# EAGLE design doogie_top_board (EAGLE 9.4.2)

## Sheet 1 of 2
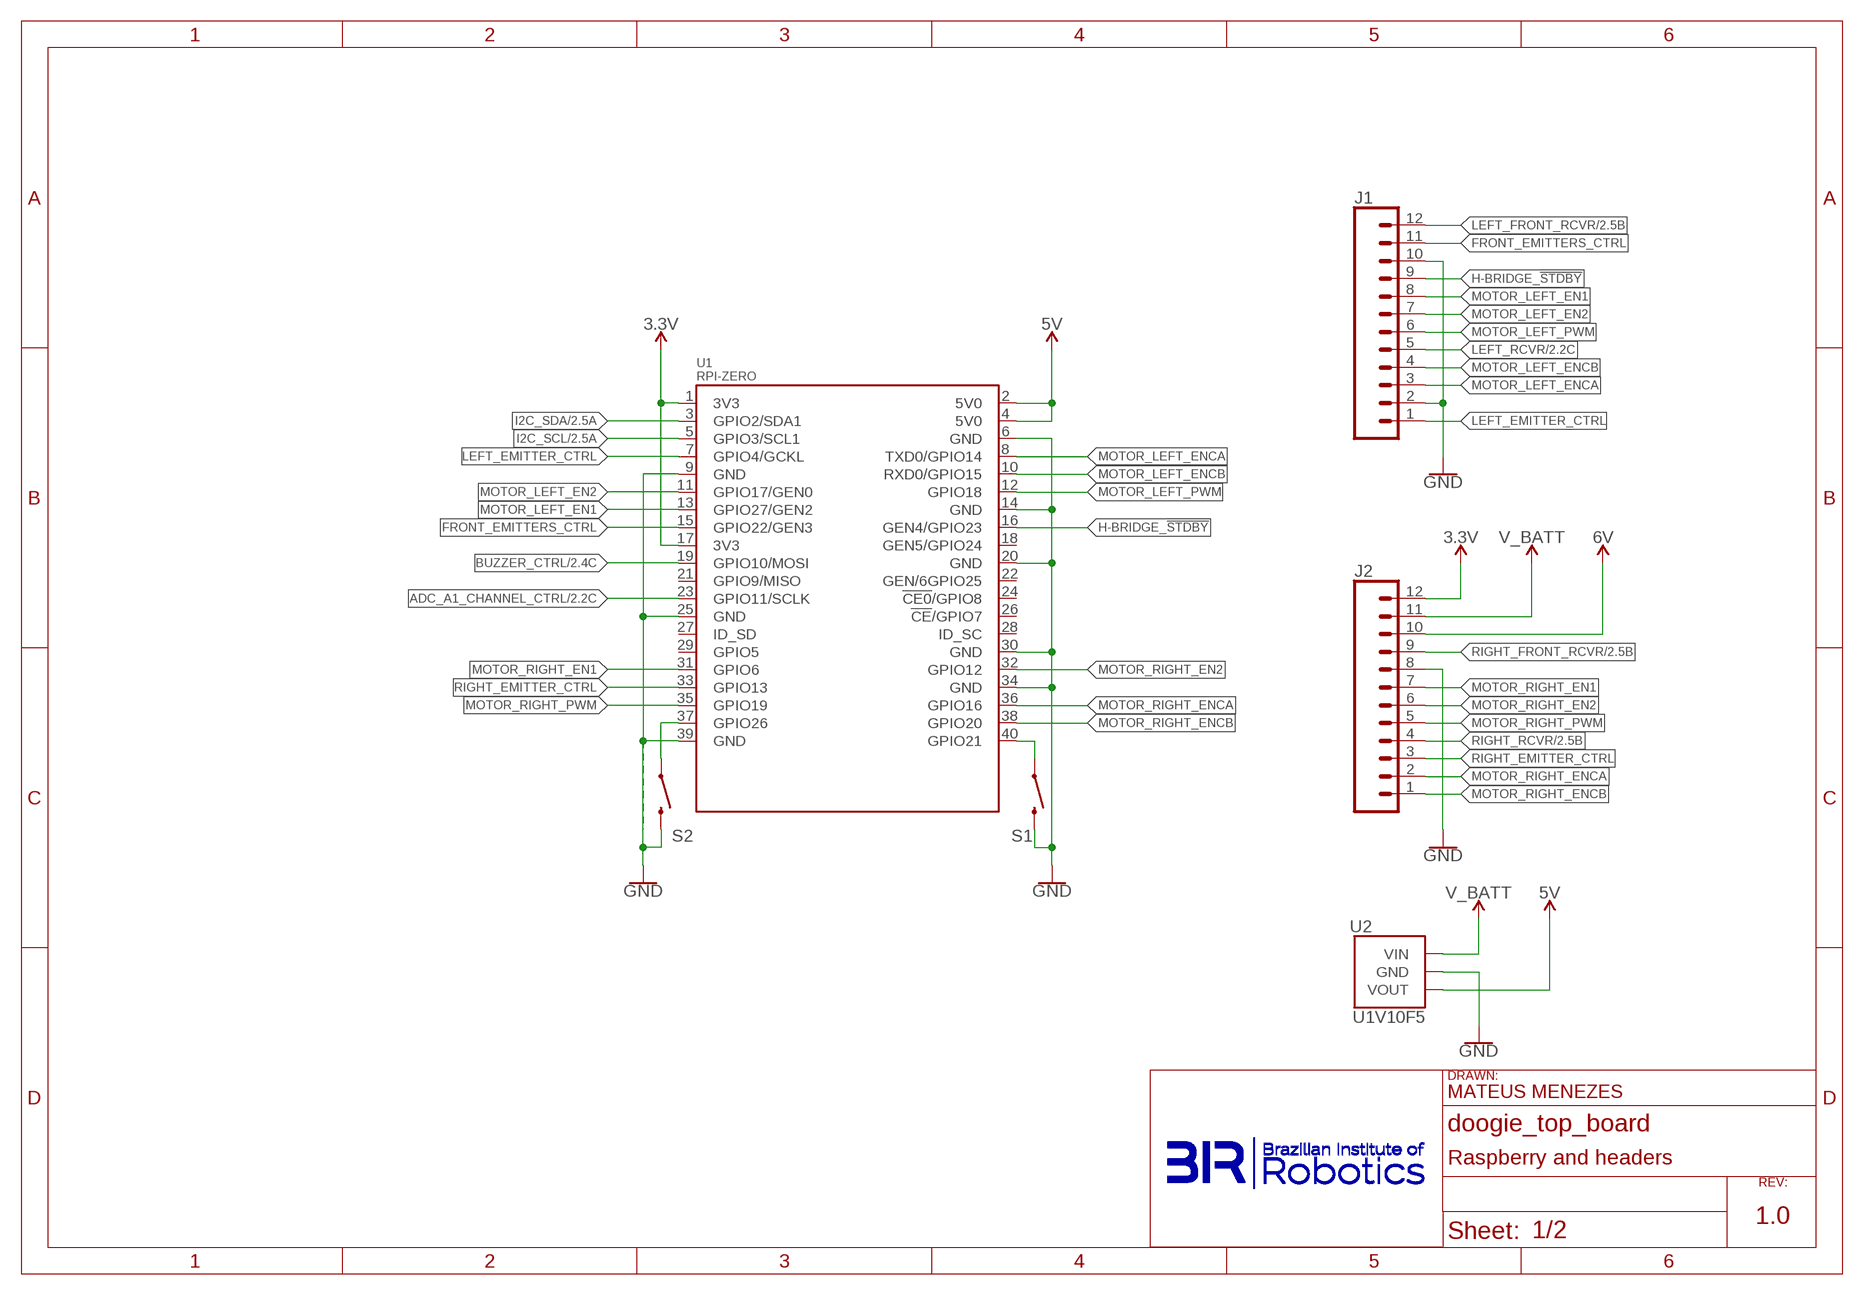
[diagram p0: schematic, sheet 1]
U$1 (FRAME_A4P): DESIGNER_NAME: MATEUS MENEZES; PAGE_DESCRIPTION: Raspberry and headers; REV_NUMBER: 1.0

### Parts
J1  CONN_12  [1X12]
J2  CONN_12  [1X12]
S1  MOMENTARY-SWITCH-SPST-PTH-6.0MM  [TACTILE_SWITCH_PTH_6.0MM]
S2  MOMENTARY-SWITCH-SPST-PTH-6.0MM  [TACTILE_SWITCH_PTH_6.0MM]
U1  RPI-ZERO  [RASPBERRYPI_BASTELSTUBE_V13_RASPI_BOARD_B+_FULL]
U2  U1V10F5  [U1V10F5]

### Nets
3.3V: J2.12 U1.1(3V3) U1.17(3V3) ; also sheet 2
5V: U1.2(5V0) U1.4(5V0) U2.VOUT ; also sheet 2
ADC_A1_CHANNEL_CTRL: U1.23(GPIO11/SCLK) ; also sheet 2
BUZZER_CTRL: U1.19(GPIO10/MOSI) ; also sheet 2
FRONT_EMITTERS_CTRL: J1.11 U1.15(GPIO22/GEN3)
GND: J1.2 J1.10 J2.8 S1.3 S2.3 U1.6(GND) U1.9(GND) U1.14(GND) U1.20(GND) U1.25(GND) U1.30(GND) U1.34(GND) U1.39(GND) U2.GND ; also sheet 2
H-BRIDGE_!STDBY: J1.9 U1.16(GEN4/GPIO23)
I2C_SCL: U1.5(GPIO3/SCL1) ; also sheet 2
I2C_SDA: U1.3(GPIO2/SDA1) ; also sheet 2
LEFT_EMITTER_CTRL: J1.1 U1.7(GPIO4/GCKL)
LEFT_FRONT_RCVR: J1.12 ; also sheet 2
LEFT_RCVR: J1.5 ; also sheet 2
MOTOR_LEFT_EN1: J1.8 U1.13(GPIO27/GEN2)
MOTOR_LEFT_EN2: J1.7 U1.11(GPIO17/GEN0)
MOTOR_LEFT_ENCA: J1.3 U1.8(TXD0/GPIO14)
MOTOR_LEFT_ENCB: J1.4 U1.10(RXD0/GPIO15)
MOTOR_LEFT_PWM: J1.6 U1.12(GPIO18)
MOTOR_RIGHT_EN1: J2.7 U1.31(GPIO6)
MOTOR_RIGHT_EN2: J2.6 U1.32(GPIO12)
MOTOR_RIGHT_ENCA: J2.2 U1.36(GPIO16)
MOTOR_RIGHT_ENCB: J2.1 U1.38(GPIO20)
MOTOR_RIGHT_PWM: J2.5 U1.35(GPIO19)
N$3: S2.1 U1.37(GPIO26)
N$4: S1.1 U1.40(GPIO21)
RIGHT_EMITTER_CTRL: J2.3 U1.33(GPIO13)
RIGHT_FRONT_RCVR: J2.9 ; also sheet 2
RIGHT_RCVR: J2.4 ; also sheet 2
V_BATT: J2.11 U2.VIN ; also sheet 2
VOUT: J2.10 ; supply symbol labelled 6V ; also sheet 2
Unconnected: U1.18(GEN5/GPIO24) U1.21(GPIO9/MISO) U1.22(GEN/6GPIO25) U1.24(!CE0!/GPIO8) U1.26(!CE!/GPIO7) U1.27(ID_SD) U1.28(ID_SC) U1.29(GPIO5)

## Sheet 2 of 2
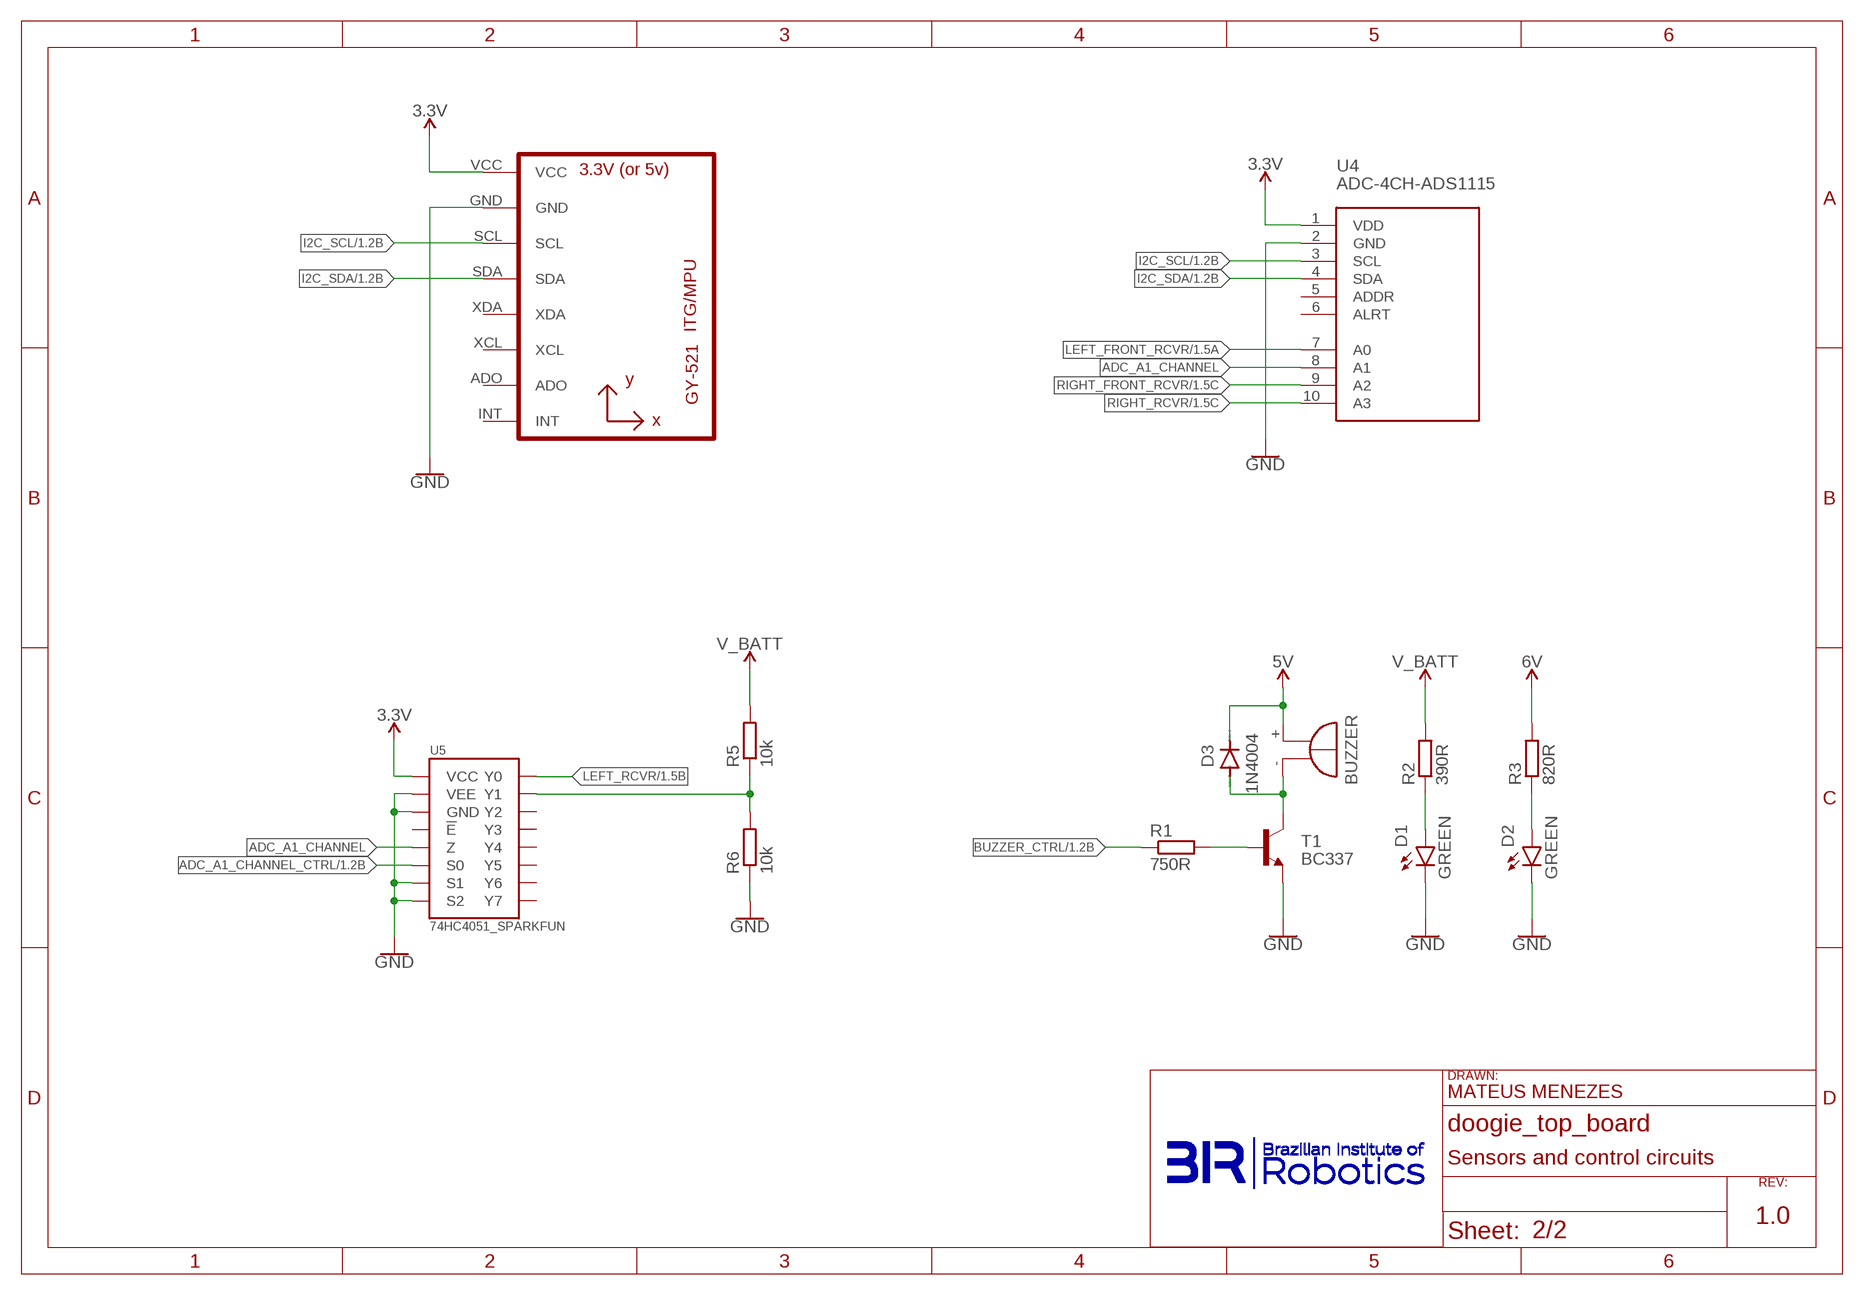
[diagram p1: schematic, sheet 2]
U$4 (FRAME_A4P): DESIGNER_NAME: MATEUS MENEZES; PAGE_DESCRIPTION: Sensors and control circuits; REV_NUMBER: 1.0

### Parts
BUZZER  F/TMB  [F/TMB]
D1  GREEN  LED3MM  [LED_3MM]
D2  GREEN  LED3MM  [LED_3MM]
D3  1N4004  [DO41-10]
R1  750R  R-EU_0204/7  [0204/7]
R2  390R  R-EU_0204/7  [0204/7]
R3  820R  R-EU_0204/7  [0204/7]
R5  10k  R-EU_0204/7  [0204/7]
R6  10k  R-EU_0204/7  [0204/7]
T1  BC337  [TO92]
U3  GY-521MPU6050  [GY-521]
U4  ADC-4CH-ADS1115  [ADC-4CH-ADS1115]
U5  74HC4051_SPARKFUN  [74HC4051_SPARKFUN]

### Nets
3.3V: U3.VCC U4.1(VDD) U5.VCC U5.VCC@1(VCC) ; also sheet 1
5V: BUZZER.+ D3.C ; also sheet 1
ADC_A1_CHANNEL: U4.8(A1) U5.Z
ADC_A1_CHANNEL_CTRL: U5.S0 ; also sheet 1
BUZZER_CTRL: R1.1 ; also sheet 1
GND: D1.K(C) D2.K(C) R6.1 T1.1(E) U3.GND U4.2(GND) U5.GND U5.GND@1(GND) U5.S1 U5.S2 U5.VEE U5.VEE@1(VEE) ; also sheet 1
I2C_SCL: U3.SCL U4.3(SCL) ; also sheet 1
I2C_SDA: U3.SDA U4.4(SDA) ; also sheet 1
LEFT_FRONT_RCVR: U4.7(A0) ; also sheet 1
LEFT_RCVR: U5.Y0 ; also sheet 1
N$1: BUZZER.- D3.A T1.3(C)
N$2: R1.2 T1.2(B)
N$5: D1.A R2.1
N$6: D2.A R3.1
N$9: R5.1 R6.2 U5.Y1
RIGHT_FRONT_RCVR: U4.9(A2) ; also sheet 1
RIGHT_RCVR: U4.10(A3) ; also sheet 1
V_BATT: R2.2 R5.2 ; also sheet 1
VOUT: R3.2 ; supply symbol labelled 6V ; also sheet 1
Unconnected: U3.ADO U3.INT U3.XCL U3.XDA U4.5(ADDR) U4.6(ALRT) U5.!E U5.Y2 U5.Y3 U5.Y4 U5.Y5 U5.Y6 U5.Y7

## Library data of the parts
BUZZER = buzzer:F/TMB: BUZZER Source: Buerklin; OC_FARNELL: unknown; OC_NEWARK: unknown
D1 D2 = SparkFun-LED:LED: LED (Generic) Standard schematic elements and footprints for 5mm, 3mm, 1206, and 0603 sized LEDs. Generic LEDs with no color specified.; PROD_ID: DIO-08794
D3 = diode:1N4004: DIODE general purpose rectifier, 1 A
J1 J2 = SparkFun-Connectors:CONN_12: Multi connection point. Often used as Generic Header-pin footprint for 0.1 inch spaced/style header connections On any of the 0.1 inch spaced packages, you can populate with these: Break Away Headers - Straight <https://www.sparkfun.com/products/116> (PRT-00116) Break Away Male Headers - Right Angle <https://www.sparkfun.com/products/553> (PRT-00553) Female Headers <https://www.sparkfun.com/products/115> (PRT-00115) Break Away Headers - Machine Pin <https://www.sparkfun.com/products/117> (PRT-00117) Break Away Female Headers - Swiss Machine Pin <https://www.sparkfun.com/products/743> (PRT-00743) For SCREWTERMINALS and SPRING TERMINALS visit here: Screw Terimnals on SparkFun.com <https://www.sparkfun.com/search/results?term=Screw+Terminals> (5mm/3.5mm/2.54mm spacing) This device is also useful as a general connection point to wire up your design to another part of your project. Our various solder wires solder well into these plated through hole pads. Hook-Up Wire - Assortment (Stranded, 22 AWG) <https://www.sparkfun.com/products/11375> (PRT-11375) Hook-Up Wire - Assortment (Solid Core, 22 AWG) <https://www.sparkfun.com/products/11367> (PRT-11367) View the entire wire category on our website here <https://www.sparkfun.com/categories/141> Special notes: Molex polarized connector foot print use with SKU : PRT-08231 with associated crimp pins and housings. 1MM SMD Version SKU: PRT-10208 NOTES ON THE VARIANTS LOCK and LOCK_LONGPADS... This footprint was designed to help hold the alignment of a through-hole component (i.e. 6-pin header) while soldering it into place. You may notice that each hole has been shifted either up or down by 0.005 of an inch from it's more standard position (which is a perfectly straight line). This slight alteration caused the pins (the squares in the middle) to touch the edges of the holes. Because they are alternating, it causes a "brace" to hold the component in place. 0.005 has proven to be the perfect amount of "off-center" position when using our standard breakaway headers. Although looks a little odd when you look at the bare footprint, once you have a header in there, the alteration is very hard to notice. Also,if you push a header all the way into place, it is covered up entirely on the bottom side.
R1-R3 R5 R6 = rcl:R-EU_: RESISTOR, European symbol; SPICEPREFIX: R
S1 S2 = SparkFun-Switches:MOMENTARY-SWITCH-SPST: Momentary Switch (Pushbutton) - SPST Normally-open (NO) SPST momentary switches (buttons, pushbuttons). Variants PTH-12MM - 12mm square, through-hole Momentary Pushbutton Switch - 12mm Square <https://www.sparkfun.com/products/9190> (COM-09190) PTH-6.0MM, PTH-6.0MM-KIT - 6.0mm square, through-hole Mini Pushbutton Switch <https://www.sparkfun.com/products/97> (COM-00097) KIT package intended for soldering kit's - only one side of pads' copper is exposed. PTH-RIGHT-ANGLE-KIT - Right-angle, through-hole Right Angle Tactile Button <https://www.sparkfun.com/products/10791> - Used on SparkFun BigTime Watch Kit <https://www.sparkfun.com/products/11734> SMD-12MM - 12mm square, surface-mount Tactile Button - SMD (12mm) <https://www.sparkfun.com/products/12993> (COM-12993) Used on SparkFun PicoBoard <https://www.sparkfun.com/products/11888> SMD-4.5MM - 4.5mm Square Trackball Switch Used on SparkFun Blackberry Trackballer Breakout <https://www.sparkfun.com/products/13169> SMD-4.6MMX2.8MM - 4.60mm x 2.80mm, surface mount Used on SparkFun SAMD21 Mini Breakout <https://www.sparkfun.com/products/13664> SMD-5.2MM, SMD-5.2-REDUNDANT - 5.2mm square, surface-mount Mini Pushbutton Switch - SMD <https://www.sparkfun.com/products/8720> (COM-08720) Used on Arduino Pro Mini <https://www.sparkfun.com/products/11114> REDUNDANT package connects both switch circuits together SMD-6.0X3.5MM - 6.0 x 3.5mm, surface mount Momentary Reset Switch SMD <https://www.sparkfun.com/products/8229> (COM-08229) SMD-6.2MM-TALL - 6.2mm square, surface mount Tactile Button - SMD (6mm) <https://www.sparkfun.com/products/12992> Used on SparkFun Digital Sandbox <https://www.sparkfun.com/products/12651> SMD-RIGHT-ANGLE - Right-angle, surface mount Used on SparkFun Block for Intel® Edison - Arduino <https://www.sparkfun.com/products/13036>; PROD_ID: SWCH-08441; SF_SKU: COM-00097
T1 = transistor:BC337: NPN TRANSISTOR
U1 = doogie:RPI-ZERO
U2 = pololu:U1V10F5: Pololu 5V Step-Up Voltage Regulator U1V10F5 This tiny (0.35″×0.45″) U1V10F5 switching step-up (or boost) voltage regulator efficiently generates 5 V from input voltages as low as 0.5 V. Unlike most boost regulators, the U1V10F5 automatically switches to a linear down-regulation mode when the input voltage exceeds the output. The pins have a 0.1″ spacing, making this board compatible with standard solderless breadboards and perfboards. More information about U1V10F5 device is available here: https://www.pololu.com/product/2564/resources
U3 = doogie:GY-521
U4 = doogie:ADC-4CH-ADS1115: 4 Channel 16-Bit Analog-to-Digital Converter based on ADS1115 chip Arduino ADS1115 Getting Started Tutorial is available here: http://henrysbench.capnfatz.com/henrys-bench/arduino-voltage-measurements/arduino-ads1115-module-getting-started-tutorial/ ADS1115 datasheet is available here: http://www.ti.com/lit/ds/symlink/ads1115.pdf Click here to find device on ebay.com <http://www.ebay.com/sch/ads1115+module>
U5 = doogie:74HC4051_SPARKFUN

## Board
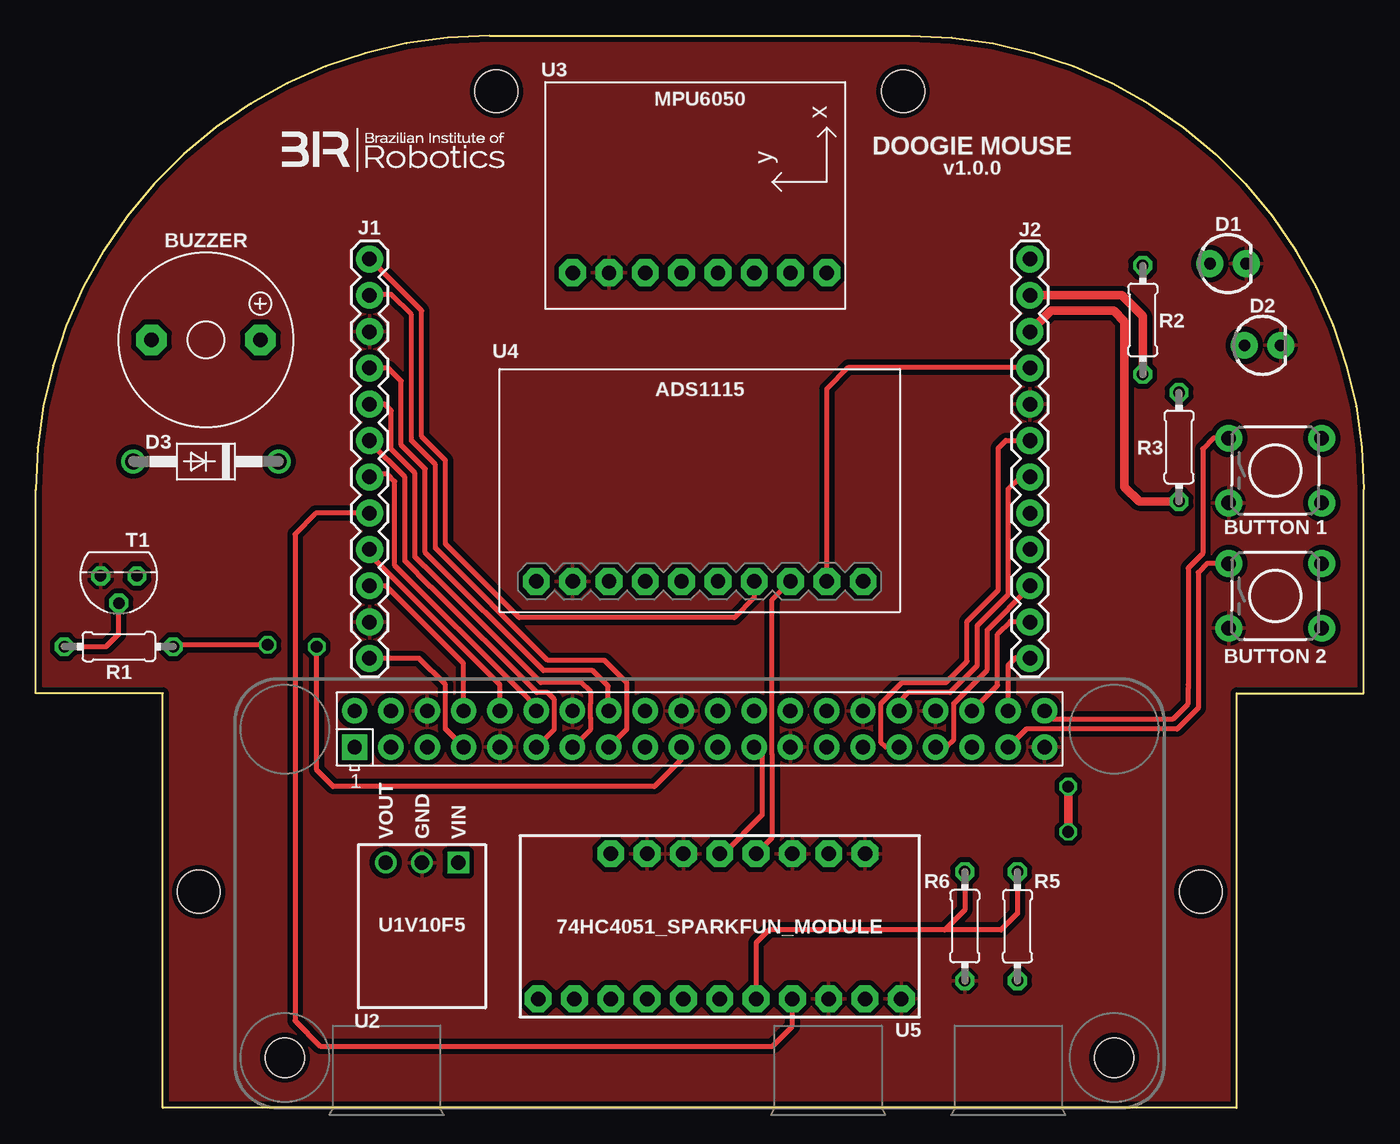
[diagram p2: board, top side]
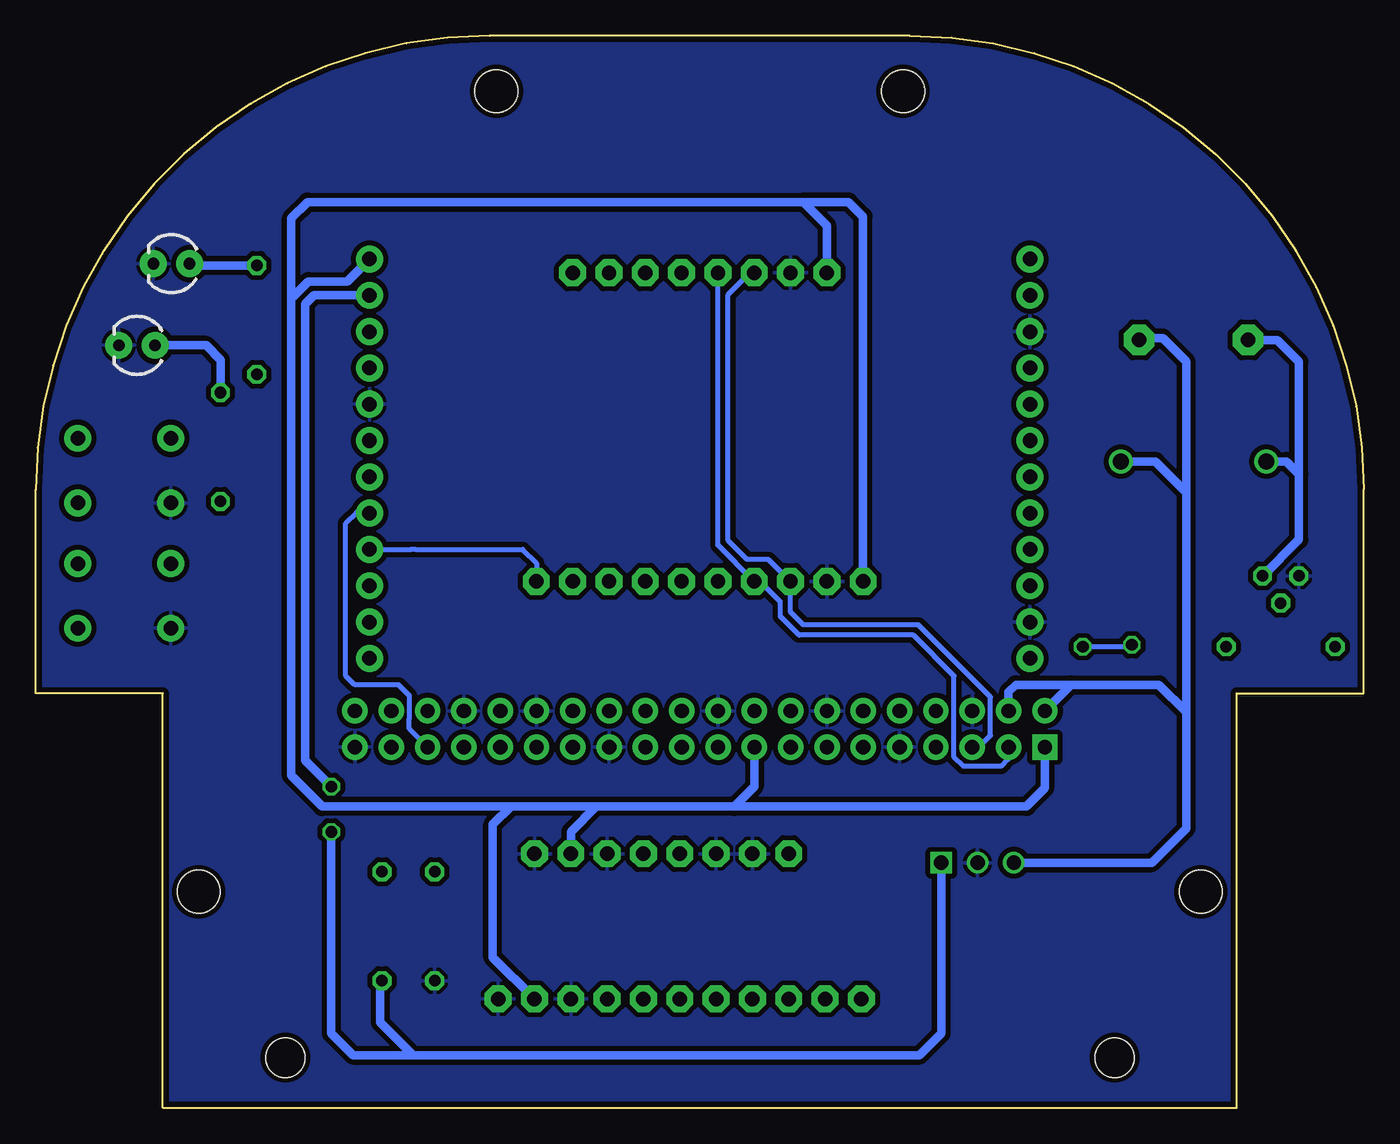
[diagram p3: board, bottom side, seen from below]

Size 92.9 x 75 mm. Coordinates in mm from the lower left corner, seen from the top.
Outline: 84.01,0 8.89,0 8.89,29 0,29 0,43.25 arc-90 31.75,75 61.15,75 arc-90 92.9,43.25 92.9,29 84.01,29 84.01,0
Copper layers (1*16): Top 0.035mm / dielectric 1.5mm / Bottom 0.035mm
Design rules "doogie_drc *": minimum track width 8mil, minimum drill 19mil, track to track 14mil, track to pad 8mil, pad to pad 8mil, via to via 8mil, smd to smd 8mil, copper to edge 10mil, drill to drill 8mil, minimum pad ring 10mil, minimum via ring 8mil, stop-mask expansion 4mil, vias tented up to drill 20mil, thermal gap 10mil
Holes 3 mm at 11.4,15.11 81.5,15.11 32.23,71.12 60.67,71.12

### Footprints (pad centres in the part's own frame; a part is rotated, then mirrored left to right if it is on the bottom)
F/TMB = drill 1.016 pad 2.159 octagon: + 3.81,0; - -3.81,0
LED_3MM = drill 0.813 pad 1.88: A -1.27,0; K 1.27,0
DO41-10 = drill 1.118: A 5.08,0; C -5.08,0
1X12 = drill 1.016 pad 1.88: 1 0,0; 2 2.54,0; 3 5.08,0; 4 7.62,0; 5 10.16,0; 6 12.7,0; 7 15.24,0; 8 17.78,0; 9 20.32,0; 10 22.86,0; 11 25.4,0; 12 27.94,0
0204/7 = drill 0.813 octagon: 1 -3.81,0; 2 3.81,0
TACTILE_SWITCH_PTH_6.0MM = drill 1.016 pad 1.88: 1 -3.251,2.261; 2 3.251,2.261; 3 -3.251,-2.261; 4 3.251,-2.261
TO92 = drill 0.813 octagon: 1 1.27,0; 2 0,1.905; 3 -1.27,0
RASPBERRYPI_BASTELSTUBE_V13_RASPI_BOARD_B+_FULL = drill 1 pad 1.778 square: 1 8.37,25.23 | drill 1 pad 1.778: 2 8.37,27.77; 3 10.91,25.23; 4 10.91,27.77; 5 13.45,25.23; 6 13.45,27.77; 7 15.99,25.23; 8 15.99,27.77; 9 18.53,25.23; 10 18.53,27.77; 11 21.07,25.23; 12 21.07,27.77; 13 23.61,25.23; 14 23.61,27.77; 15 26.15,25.23; 16 26.15,27.77; 17 28.69,25.23; 18 28.69,27.77; 19 31.23,25.23; 20 31.23,27.77; 21 33.77,25.23; 22 33.77,27.77; 23 36.31,25.23; 24 36.31,27.77; 25 38.85,25.23; 26 38.85,27.77; 27 41.39,25.23; 28 41.39,27.77; 29 43.93,25.23; 30 43.93,27.77; 31 46.47,25.23; 32 46.47,27.77; 33 49.01,25.23; 34 49.01,27.77; 35 51.55,25.23; 36 51.55,27.77; 37 54.09,25.23; 38 54.09,27.77; 39 56.63,25.23; 40 56.63,27.77 | hole 2.75: 3.5,3.5; 61.5,3.5
U1V10F5 = drill 1: GND -4.445,0; VOUT -4.445,-2.54 | drill 1 square: VIN -4.445,2.54
GY-521 = drill 1 pad 1.88 octagon: ADO -8.89,-6.35; GND -8.89,6.35; INT -8.89,-8.89; SCL -8.89,3.81; SDA -8.89,1.27; VCC -8.89,8.89; XCL -8.89,-3.81; XDA -8.89,-1.27
ADC-4CH-ADS1115 = drill 1 pad 1.88 octagon: 1 -6.35,11.43; 2 -6.35,8.89; 3 -6.35,6.35; 4 -6.35,3.81; 5 -6.35,1.27; 6 -6.35,-1.27; 7 -6.35,-3.81; 8 -6.35,-6.35; 9 -6.35,-8.89; 10 -6.35,-11.43
74HC4051_SPARKFUN = drill 1.016 pad 1.88 octagon: !E -5.08,-7.62; GND 5.08,7.62; GND@1 -5.08,5.08; S0 -5.08,0; S1 -5.08,-2.54; S2 -5.08,-5.08; VCC 5.08,10.16; VCC@1 -5.08,7.62; VEE 5.08,12.7; VEE@1 -5.08,10.16; Y0 5.08,5.08; Y1 5.08,2.54; Y2 5.08,0; Y3 5.08,-2.54; Y4 5.08,-5.08; Y5 5.08,-7.62; Y6 5.08,-10.16; Y7 5.08,-12.7; Z -5.08,2.54

### Placement (x,y rotation side)
BUZZER  11.91,53.72 0 top
D1  83.41,59.05 0 top
D2  85.82,53.34 0 top
D3  11.91,45.21 180 top
J1  23.35,31.44 90 top
J2  69.55,31.44 90 top
R1  5.81,32.26 180 top
R2  77.44,55.12 270 top
R3  79.98,46.23 270 top
R5  68.68,12.7 270 top
R6  64.99,12.7 90 top
S1  86.71,44.58 0 top
S2  86.71,35.81 0 top
T1  5.81,37.21 180 top
U1  13.94,0 0 top
U2  27.02,12.7 270 top
U3  46.45,67.31 90 top
U4  46.45,43.18 90 top
U5  47.85,12.7 270 top

### Tracks (layer width: path | path; a pad name or v marks a point on that pad's centre or on a via)
3.3V
  Bottom 0.61: U1.1 22.31,22.36 23.59,21.08 44.04,21.08 | 44.04,21.08 53.69,21.08 | 53.69,21.08 59.66,21.08 | 59.66,21.08 72.87,21.08 75.03,23.24 75.03,56.61 | 75.03,56.61 75.03,62.23 73.88,63.37 39.21,63.37 | 39.21,63.37 37.56,61.72 U3.VCC | U1.17 42.63,22.49 44.04,21.08 | U4.1 35.02,62.36 36.04,63.37 39.21,63.37 | U5.VCC@1 55.47,19.3 53.69,21.08 | U5.VCC 60.93,10.54 60.93,19.81 59.66,21.08 | 75.03,56.61 73.83,57.8 71.12,57.8 J2.12
5V
  Bottom 0.61: U2.VOUT 14.83,17.14 12.41,19.56 12.41,27.69 | BUZZER.+ 15.59,53.85 14.07,53.85 12.41,52.2 12.41,43.05 | 12.41,27.69 12.41,43.05 | 12.41,43.05 14.57,45.21 D3.C | U1.4 24.85,29.09 24.35,29.59 20.49,29.59 | 20.49,29.59 14.32,29.59 12.41,27.69 | U1.2 20.49,29.59
ADC_A1_CHANNEL
  Top 0.356: U5.Z 51.53,18.92 51.53,24.69 51.52,24.7 51.52,35.55 U4.8
ADC_A1_CHANNEL_CTRL
  Top 0.356: U1.23 50.81,24.67 50.81,20.49 48.1,17.78 U5.S0
BUZZER_CTRL  (via drill 0.81)
  Top 0.356: U1.19 45.17,24.37 43.28,22.48 20.8,22.48 19.65,23.62 v19.65,32.26 | v16.22,32.38 9.75,32.38 R1.1
  Bottom 0.356: v19.65,32.26 16.35,32.26 v16.22,32.38
FRONT_EMITTERS_CTRL
  Top 0.356: U1.15 41.36,26.5 41.36,29.73 39.79,31.3 35.81,31.3 27.96,39.15 27.96,44.99 26.28,46.67 26.28,55.47 24.86,56.9 23.41,56.9 J1.11
GND
  pour Top (isolate 0.356): 0,43.25 0,29 8.89,29 8.89,0 84.01,0 84.01,29 92.9,29 92.9,43.25 arc90 61.15,75 31.75,75 arc90
  pour Bottom (isolate 0.356): 0,43.25 0,29 8.89,29 8.89,0 84.01,0 84.01,29 92.9,29 92.9,43.25 arc90 61.15,75 31.75,75 arc90
H-BRIDGE_!STDBY
  Top 0.356: U1.16 40.05,27.81 40.05,29.5 38.96,30.59 35.52,30.59 27.25,38.86 27.25,44.7 25.57,46.38 25.57,50.85 24.66,51.76 J1.9
I2C_SCL
  Bottom 0.356: U1.5 26.93,25.23 26.12,26.05 26.12,28.73 31.17,33.78 39.21,33.78 40.1,34.67 U4.3 41.64,38.37 43.15,38.37 44.47,39.7 44.47,56.88 42.93,58.42 U3.SCL
I2C_SDA
  Bottom 0.356: U1.3 24.85,24.39 25.36,23.88 28.02,23.88 28.66,24.52 28.66,30.21 31.52,33.07 39.51,33.07 40.81,34.38 40.81,35.4 42.25,36.83 U4.4 45.18,39.37 U3.SDA
LEFT_EMITTER_CTRL
  Top 0.356: U1.7 28.66,26.5 28.66,29.6 26.82,31.44 J1.1
LEFT_FRONT_RCVR
  Top 0.356: J1.12 23.38,59.38 26.99,55.77 26.99,46.96 28.67,45.29 28.67,39.45 33.83,34.29 48.86,34.29 50.26,35.69 U4.7
LEFT_RCVR
  Top 0.356: J1.5 19.6,41.6 18.13,40.13 18.13,6.1 19.91,4.32 51.53,4.32 52.93,5.71 U5.Y0
MOTOR_LEFT_EN1
  Top 0.356: U1.13 38.83,26.51 38.83,27.23 38.82,27.24 38.82,28.3 38.83,28.31 38.83,29.08 38.16,29.75 35.35,29.75 27.23,37.87 27.21,37.87 26.54,38.54 26.54,44.4 24.86,46.08 24.86,48.77 24.41,49.22 J1.8
MOTOR_LEFT_EN2
  Top 0.356: J1.7 23.35,46.58 25.83,44.11 25.83,38.24 27.62,36.45 27.64,36.45 35.05,29.04 35.79,29.04 36.28,28.55 36.28,26.5 U1.11
MOTOR_LEFT_ENCA
  Top 0.356: U1.8 29.93,31.09 24.49,36.52 J1.3
MOTOR_LEFT_ENCB
  Top 0.356: U1.10 32.47,29.59 23.35,38.71 J1.4
MOTOR_LEFT_PWM
  Top 0.356: U1.12 35.01,28.08 33.94,29.15 33.94,29.12 25.11,37.95 25.11,43.81 24.61,44.32 23.54,44.32 J1.6
MOTOR_RIGHT_EN1
  Top 0.356: J2.7 67.86,46.68 67.33,46.15 67.33,36.22 65.14,34.03 65.14,31.23 63.66,29.75 60.59,29.75 59.14,28.3 59.14,25.54 59.45,25.23 U1.31
MOTOR_RIGHT_EN2
  Top 0.356: J2.6 68.87,44.14 68.04,43.31 68.04,35.92 65.86,33.74 65.86,30.94 63.96,29.04 61.01,29.04 60.41,28.44 U1.32
MOTOR_RIGHT_ENCA
  Top 0.356: U1.36 67.28,29.56 67.28,33.15 68.17,34.04 69.49,34.04 J2.2
MOTOR_RIGHT_ENCB
  Top 0.356: U1.38 68.03,30.98 68.55,31.5 69.49,31.5 J2.1
MOTOR_RIGHT_PWM
  Bottom 0.356: J2.5 69.61,41.66 70.45,41.66 71.22,40.89 71.22,30.23 70.58,29.59 67.53,29.59 66.76,28.82 66.76,27.24 66.77,27.23 66.77,26.51 U1.35
N$1
  Bottom 0.61: T1.3 4.54,39.75 4.54,44.32 | BUZZER.- 6.06,53.72 4.54,52.2 4.54,44.32 | D3.A 5.43,45.21 4.54,44.32
N$2
  Top 0.356: R1.2 4.92,32.26 5.81,33.15 T1.2
N$3
  Top 0.356: U1.37 69.3,26.5 79.86,26.5 81.32,27.97 81.32,37.47 81.96,38.1 83.43,38.1 S2.1
N$4
  Top 0.356: S1.1 82.37,46.84 81.63,46.1 81.63,38.78 80.61,37.76 80.61,29.59 80.61,29.34 80.61,28.26 79.56,27.21 71.13,27.21 U1.40
N$5
  Bottom 0.61: R2.1 82.01,58.93 D1.A
N$6
  Bottom 0.61: R3.1 79.98,52.32 80.99,53.34 D2.A
N$9
  Top 0.356: R5.1 68.68,13.59 67.53,12.45 63.59,12.45 | U5.Y1 50.39,11.56 51.28,12.45 63.59,12.45 | R6.2 64.99,13.84 63.59,12.45
RIGHT_EMITTER_CTRL
  Top 0.356: U1.33 63.71,25.23 64.22,25.74 64.22,28.3 66.57,30.64 66.57,33.44 69.55,36.42 J2.3
RIGHT_FRONT_RCVR
  Top 0.356: U4.9 55.34,50.29 56.86,51.82 69.49,51.82 J2.9
RIGHT_RCVR
  Bottom 0.356: J2.4 66.64,39.06 66.33,39.06 58.84,39.06 57.88,38.1 U4.10
V_BATT  (via drill 0.81)
  Top 0.61: J2.11 75.97,56.84 77.44,55.37 R2.2 | v72.23,22.48 v72.23,19.3
  Bottom 0.61: J2.11 73.43,56.84 74.06,56.21 74.06,24.31 v72.23,22.48 | v72.23,19.3 72.23,5.21 70.71,3.68 66.52,3.68 | 66.52,3.68 31.08,3.68 29.56,5.21 U2.VIN | R5.2 68.8,8.76 68.8,5.97 66.52,3.68
VOUT
  Top 0.61: J2.10 71,55.75 75.41,55.75 76.17,54.99 76.17,43.43 77.18,42.42 R3.2

### Text on the board
tNames: DOOGIE MOUSE | v1.0.0 | BUTTON 1 | BUTTON 2